# EasyEDA schematic Traffic Light Control System.json
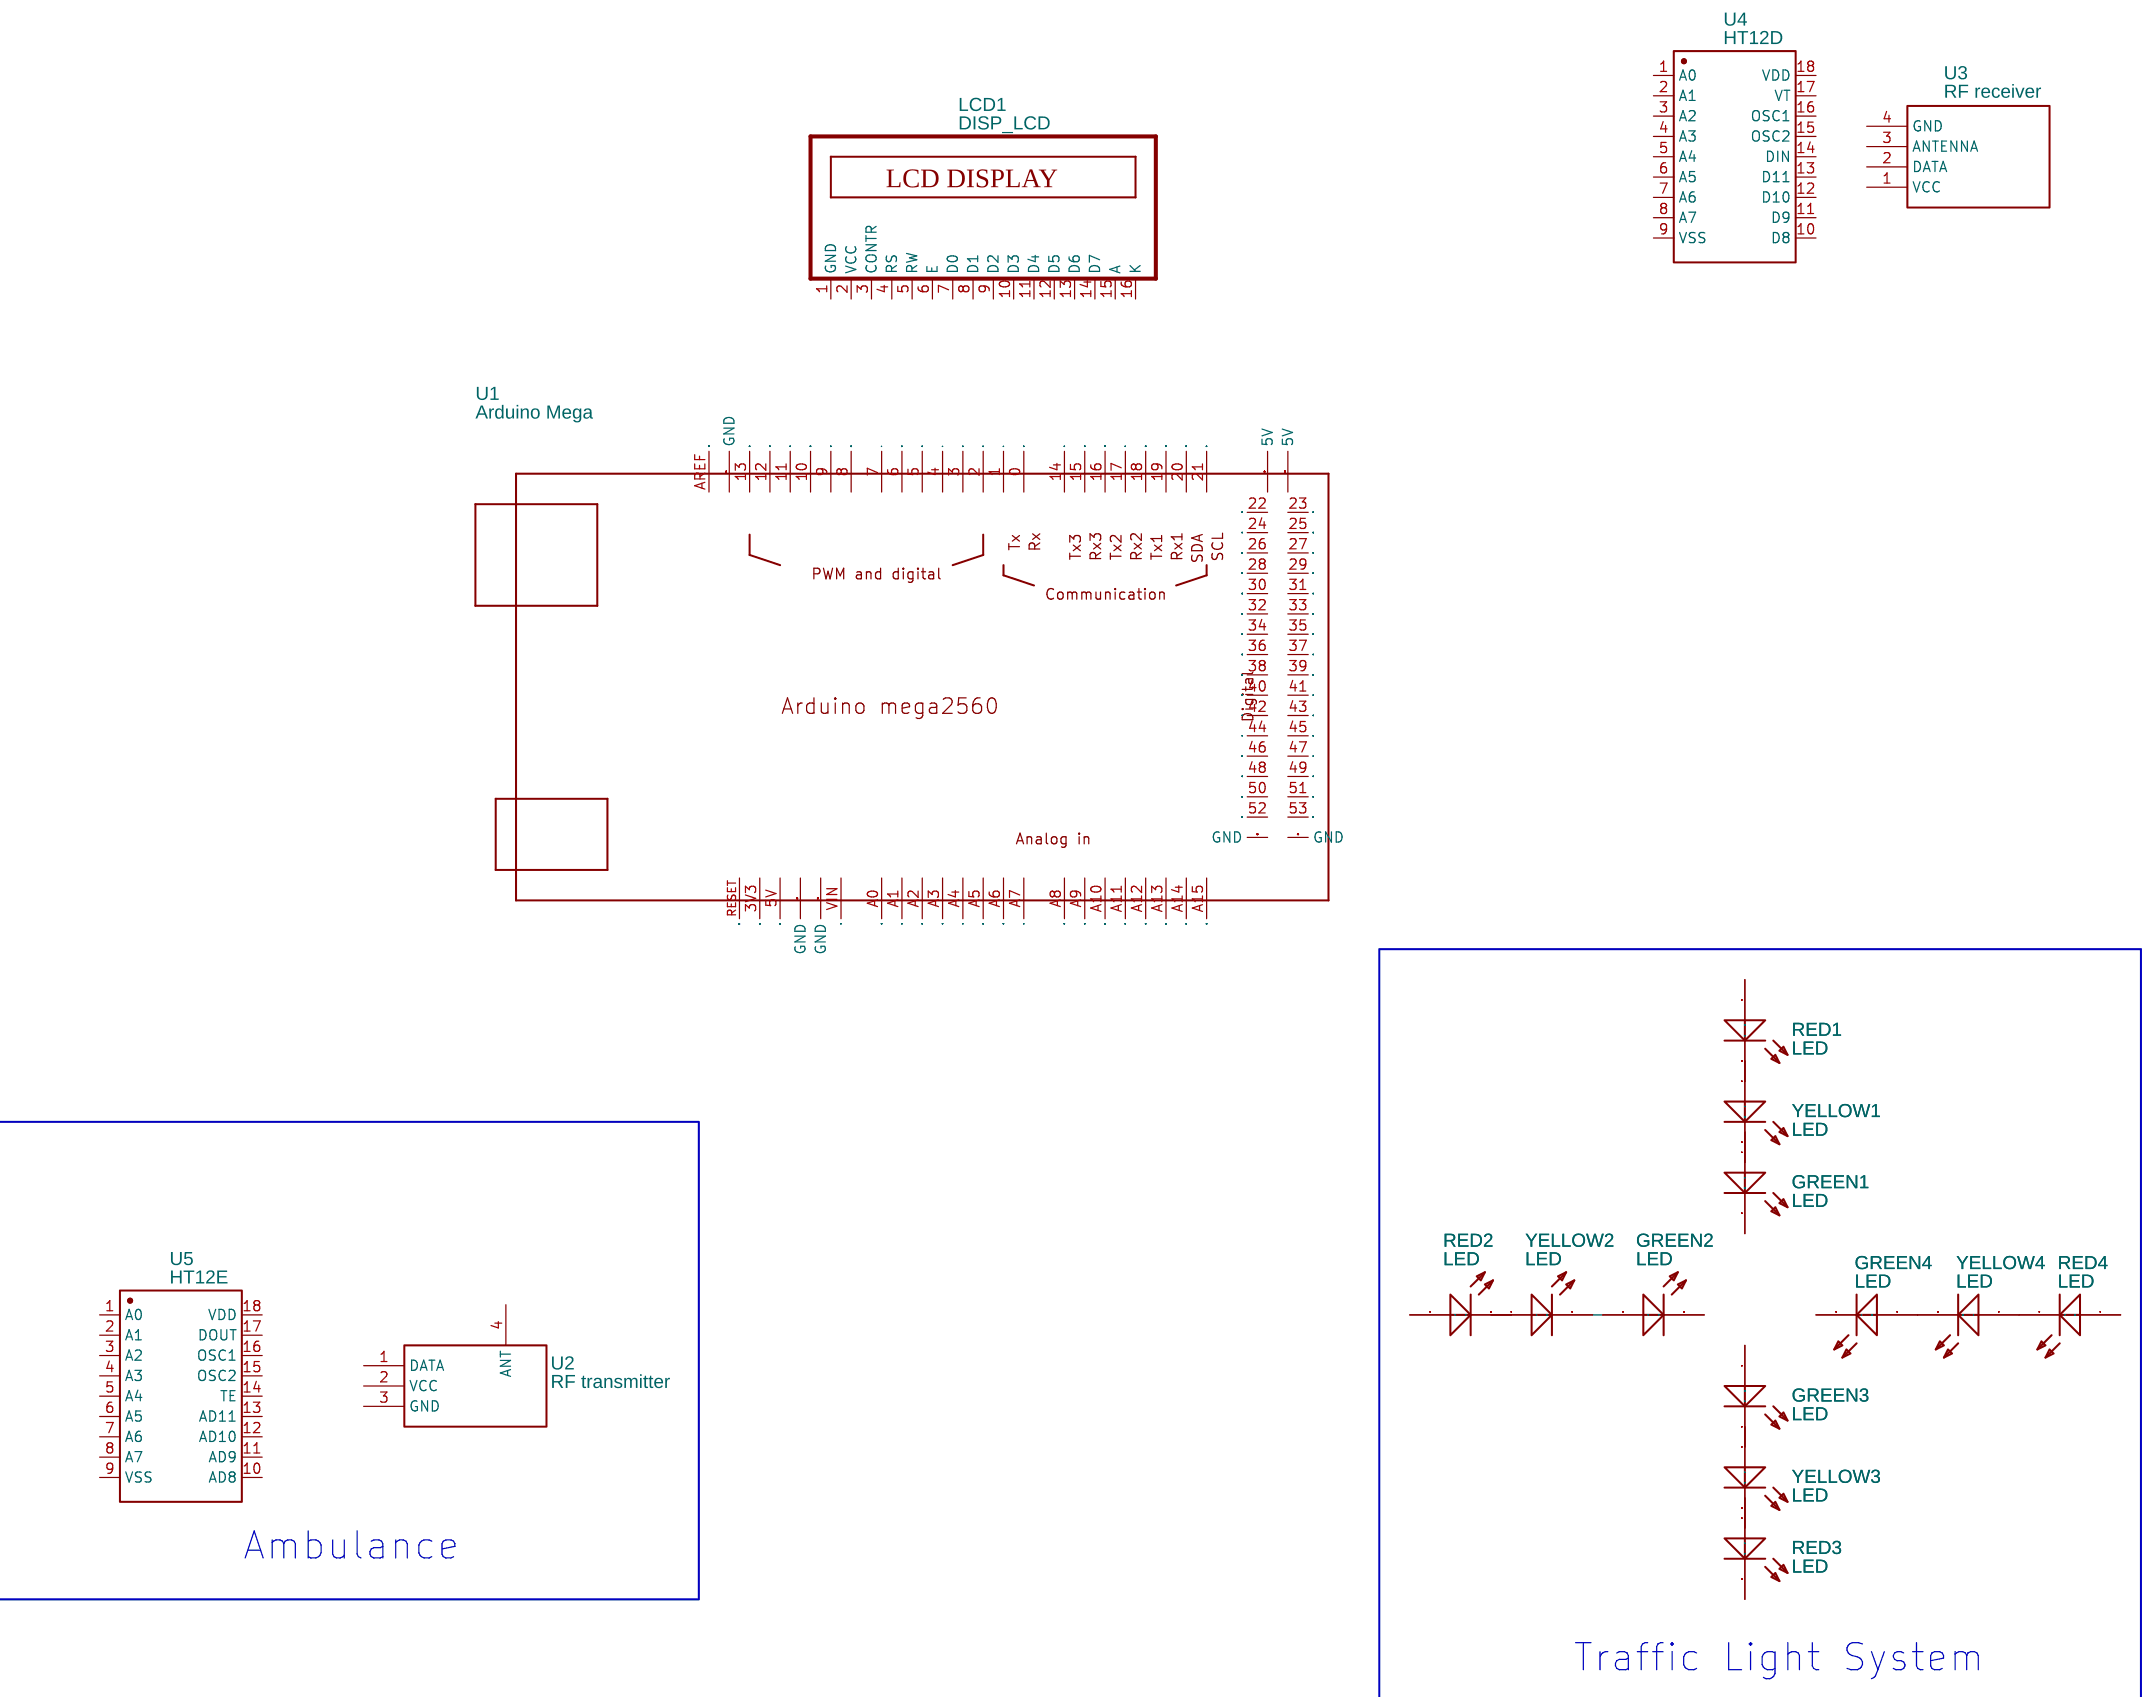
[diagram p0: schematic sheet]

## Parts
GREEN1  LED  [LED0805-YELLOW]
GREEN2  LED  [LED0805-YELLOW]
GREEN3  LED  [LED0805-YELLOW]
GREEN4  LED  [LED0805-YELLOW]
LCD1  DISP_LCD  [DISP_LCD_4X20]
RED1  LED  [LED0805-YELLOW]
RED2  LED  [LED0805-YELLOW]
RED3  LED  [LED0805-YELLOW]
RED4  LED  [LED0805-YELLOW]
U1  Arduino Mega  [MODULE]
U2  RF transmitter  [RF TRANSMITTER]
U3  RF receiver  [DIP]
U4  HT12D  [DIP-18]
U5  HT12E  [DIP18]
YELLOW1  LED  [LED0805-YELLOW]
YELLOW2  LED  [LED0805-YELLOW]
YELLOW3  LED  [LED0805-YELLOW]
YELLOW4  LED  [LED0805-YELLOW]

## Library data of the parts
GREEN1-GREEN4 RED1-RED4 YELLOW1-YELLOW4 = LED: RO LED GEEL HSMY-C170 0805  AVAGO
LCD1 = DISP_LCD: Contributor: DangerousPrototype
U1 = Arduino Mega: Micro Controler device; Contributor: harte385
U2 = RF transmitter: Contributor: shirtylpminecraft
U3 = RF receiver: Contributor: Jaumard
U4 = HT12D: Supplier: LCSC; Manufacturer: HOLTEK; image: //image.lceda.cn/szlcsc/C14360.jpg; Supplier Part: C14360; Contributor: Juan Manuel Barberena Budiño
U5 = HT12E: Contributor: naat

## Nets
Net-(GREEN2-1): GREEN2.1(A) YELLOW2.2(K)
Net-(GREEN4-1): GREEN4.1(A) YELLOW4.2(K)
Net-(RED1-2): RED1.2(K) YELLOW1.1(A)
Net-(RED4-2): RED4.2(K) YELLOW4.1(A)

Not connected (* = marked no-connect by the designer): GREEN1 1(A) 2(K); GREEN2 2(K); GREEN3 1(A) 2(K); GREEN4 2(K); LCD1 1(GND) 2(VCC) 3(CONTR) 4(RS) 5(RW) 6(E) 7(D0) 8(D1) 9(D2) 10(D3) 11(D4) 12(D5) 13(D6) 14(D7) 15(A) 16(K); RED1 1(A); RED2 1(A) 2(K); RED3 1(A) 2(K); RED4 1(A); U1 0 1 2 3 3V3 4 5 5V 6 7 8 9 10 11 12 13 14 15 16 17 18 19 20 21 22 23 24 25 26 27 28 29 30 31 32 33 34 35 36 37 38 39 40 41 42 43 44 45 46 47 48 49 50 51 52 53 A0 A1 A2 A3 A4 A5 A6 A7 A8 A9 A10 A11 A12 A13 A14 A15 AREF GND@1(GND) GND@2(GND) GND@3(GND) GND@4(5V) GND@5(5V) GND@6(GND) GND@7(GND) RESET VIN; U2 1(DATA) 2(VCC) 3(GND) 4(ANT); U3 1(VCC) 2(DATA) 3(ANTENNA) 4(GND); U4 1(A0) 2(A1) 3(A2) 4(A3) 5(A4) 6(A5) 7(A6) 8(A7) 9(VSS) 10(D8) 11(D9) 12(D10) 13(D11) 14(DIN) 15(OSC2) 16(OSC1) 17(VT) 18(VDD); U5 1(A0) 2(A1) 3(A2) 4(A3) 5(A4) 6(A5) 7(A6) 8(A7) 9(VSS) 10(AD8) 11(AD9) 12(AD10) 13(AD11) 14(TE) 15(OSC2) 16(OSC1) 17(DOUT) 18(VDD); YELLOW1 2(K); YELLOW2 1(A); YELLOW3 1(A) 2(K)

## Notes on the sheet
- Ambulance
- Traffic Light System
